# EAGLE design electronic_load_V02.0 (EAGLE 7.3.0)

## Sheet 1 of 2
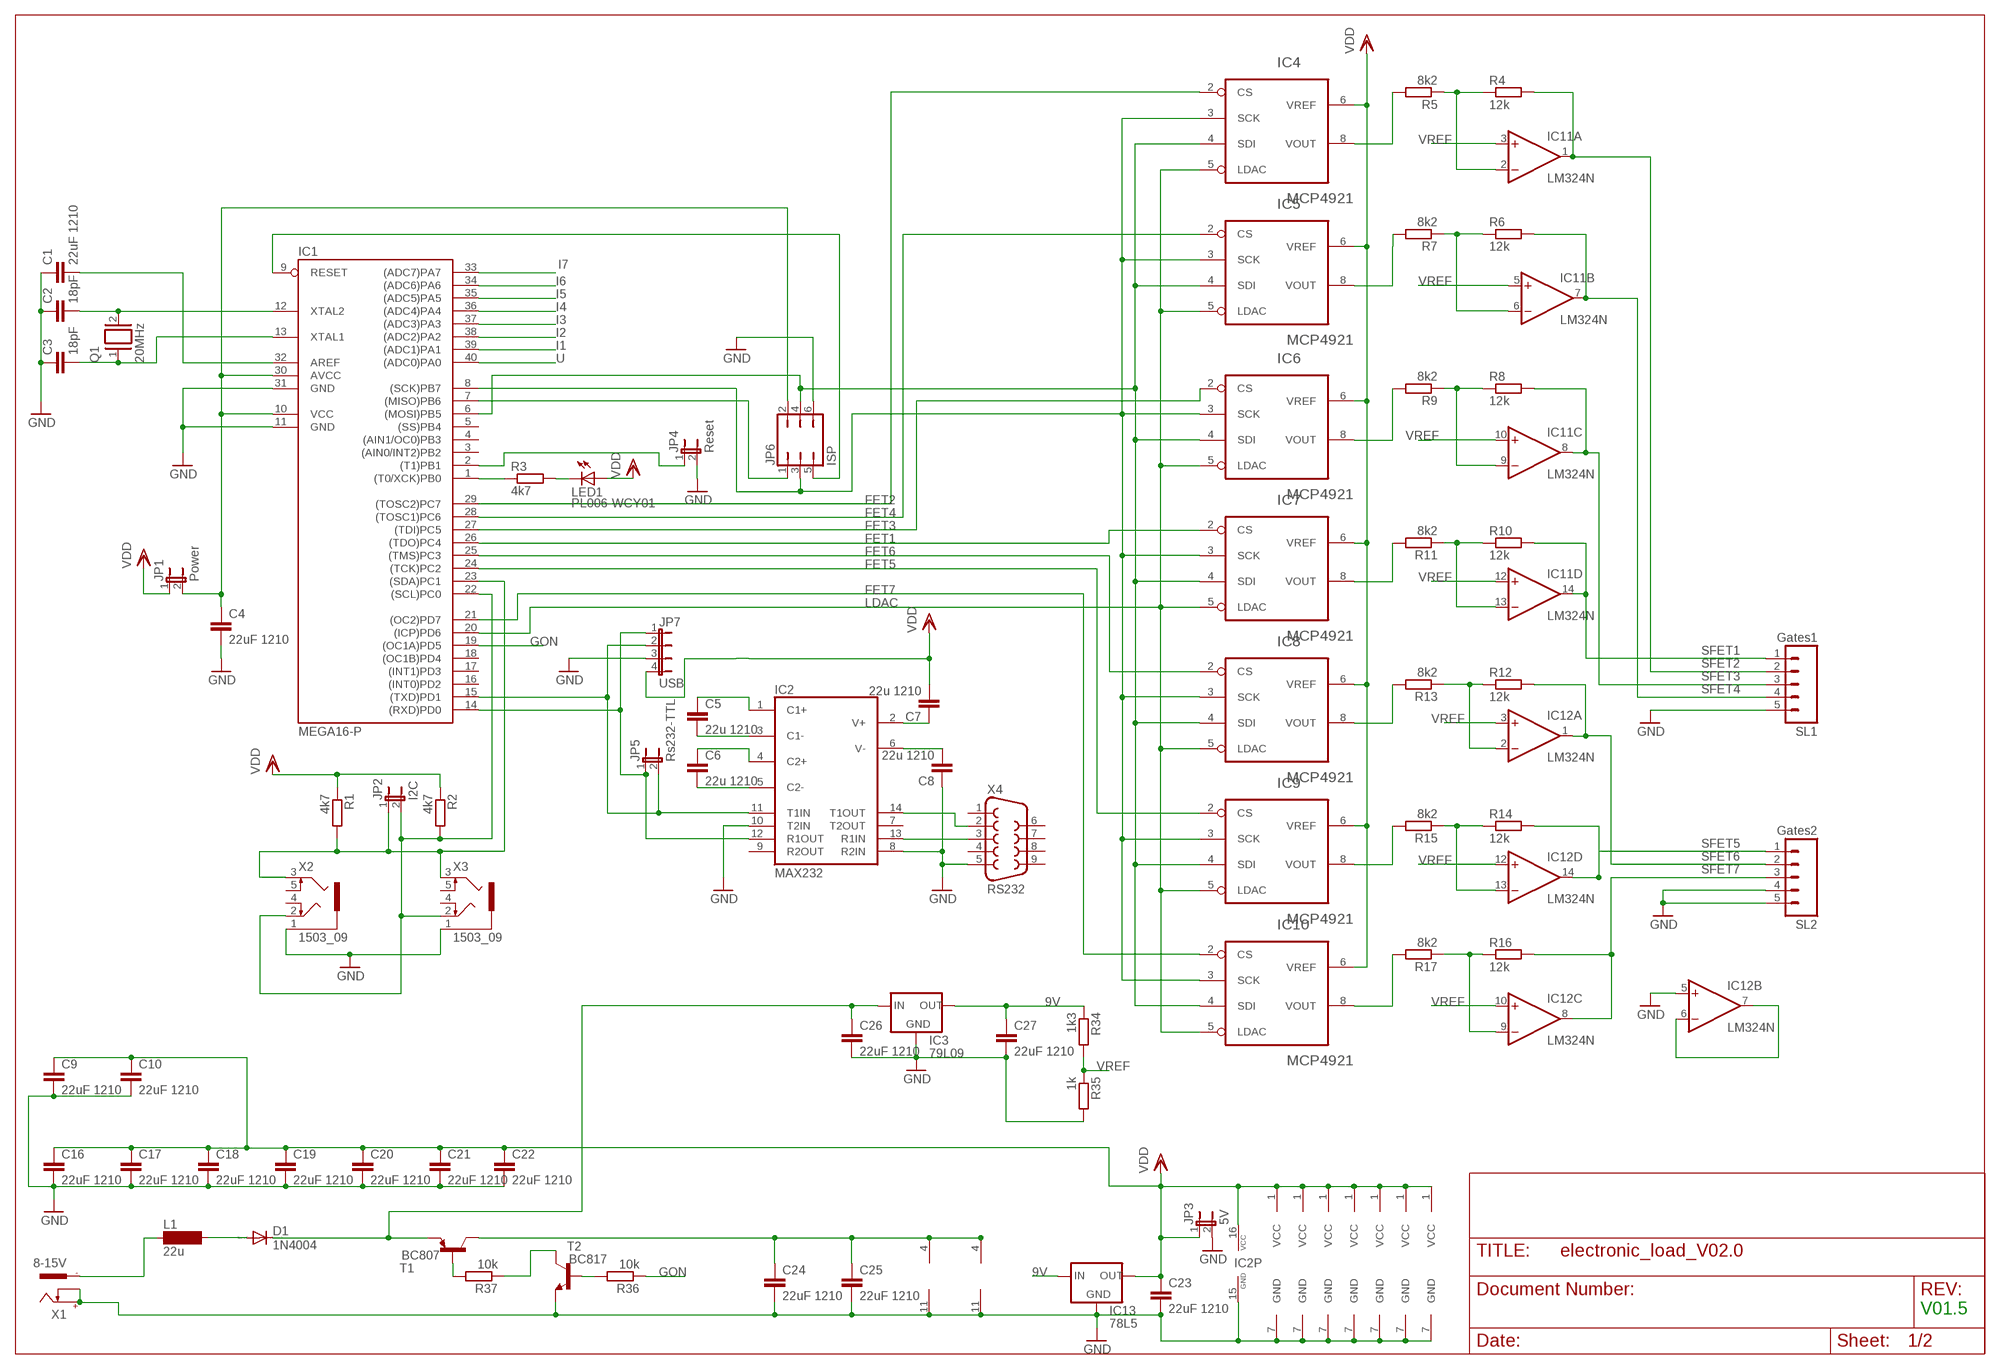
[diagram p0: schematic, sheet 1]

### Parts
C1  22uF 1210  C-EUC1206  [C1206]
C2  18pF  C-EU025-025X050  [C025-025X050]
C3  18pF  C-EU025-025X050  [C025-025X050]
C4  22uF 1210  C-EUC1206  [C1206]
C5  22u 1210  C-EUC1206  [C1206]
C6  22u 1210  C-EUC1206  [C1206]
C7  22u 1210  C-EUC1206  [C1206]
C8  22u 1210  C-EUC1206  [C1206]
C9  22uF 1210  C-EUC1206  [C1206]
C10  22uF 1210  C-EUC1206  [C1206]
C16  22uF 1210  C-EUC1206  [C1206]
C17  22uF 1210  C-EUC1206  [C1206]
C18  22uF 1210  C-EUC1206  [C1206]
C19  22uF 1210  C-EUC1206  [C1206]
C20  22uF 1210  C-EUC1206  [C1206]
C21  22uF 1210  C-EUC1206  [C1206]
C22  22uF 1210  C-EUC1206  [C1206]
C23  22uF 1210  C-EUC1206  [C1206]
C24  22uF 1210  C-EUC1206  [C1206]
C25  22uF 1210  C-EUC1206  [C1206]
C26  22uF 1210  C-EUC1206  [C1206]
C27  22uF 1210  C-EUC1206  [C1206]
D1  1N4004  [DO41-10]
IC1  MEGA16-P  [DIL40]
IC2  MAX232  [DIL16]
IC3  79L09  78LXX  [78LXX]
IC4  MCP4921  MCP491  [DIL08]
IC5  MCP4921  MCP491  [DIL08]
IC6  MCP4921  MCP491  [DIL08]
IC7  MCP4921  MCP491  [DIL08]
IC8  MCP4921  MCP491  [DIL08]
IC9  MCP4921  MCP491  [DIL08]
IC10  MCP4921  MCP491  [DIL08]
IC11  LM324N  [DIL14]
IC12  LM324N  [DIL14]
IC13  78L5  78LXX  [78LXX]
JP1  Power  JP1E  [JP1]
JP2  I2C  JP1E  [JP1]
JP3  5V  JP1E  [JP1]
JP4  Reset  JP1E  [JP1]
JP5  Rs232-TTL  JP1E  [JP1]
JP6  ISP  JP3Q  [JP3Q]
JP7  USB  JP4E  [JP4]
L1  22u  MS85  [MS85]
LED1  PL006-WCY01  [SOT23]
Q1  20MHz  XTAL/S  [QS]
R1  4k7  R-EU_0207/2V  [0207/2V]
R2  4k7  R-EU_0207/2V  [0207/2V]
R3  4k7  R-EU_R1206  [R1206]
R4  12k  R-EU_R1206  [R1206]
R5  8k2  R-EU_R1206  [R1206]
R6  12k  R-EU_R1206  [R1206]
R7  8k2  R-EU_R1206  [R1206]
R8  12k  R-EU_R1206  [R1206]
R9  8k2  R-EU_R1206  [R1206]
R10  12k  R-EU_R1206  [R1206]
R11  8k2  R-EU_R1206  [R1206]
R12  12k  R-EU_R1206  [R1206]
R13  8k2  R-EU_R1206  [R1206]
R14  12k  R-EU_R1206  [R1206]
R15  8k2  R-EU_R1206  [R1206]
R16  12k  R-EU_R1206  [R1206]
R17  8k2  R-EU_R1206  [R1206]
R34  1k3  R-EU_R1206  [R1206]
R35  1k  R-EU_R1206  [R1206]
R36  10k  R-EU_R1206  [R1206]
R37  10k  R-EU_R1206  [R1206]
SL1  Gates1  M05  [05P]
SL2  Gates2  M05  [05P]
T1  BC807  BC807-16-PNP-SOT23-BEC  [SOT23-BEC]
T2  BC817  BC817-16-NPN-SOT23-BEC  [SOT23-BEC]
X1  8-15V  737992-55  [737992-5]
X2  1503_09  [1503_09]
X3  1503_09  [1503_09]
X4  RS232  F09H  [F09H]

### Nets
9V: C27.1 IC3.OUT IC13.IN R34.1
C13: C5.1 IC2.1(C1+)
FET1: IC1.26((TDO)PC4) IC7.2(CS)
FET2: IC1.29((TOSC2)PC7) IC4.2(CS)
FET3: IC1.27((TDI)PC5) IC6.2(CS)
FET4: IC1.28((TOSC1)PC6) IC5.2(CS)
FET5: IC1.24((TCK)PC2) IC9.2(CS)
FET6: IC1.25((TMS)PC3) IC8.2(CS)
FET7: IC1.21((OC2)PD7) IC10.2(CS)
GND: C1.1 C2.1 C3.1 C4.2 C8.1 C9.2 C10.2 C16.2 C17.2 C18.2 C19.2 C20.2 C21.2 C22.2 C23.2 C24.2 C25.2 C26.2 C27.2 IC1.11(GND) IC1.31(GND) IC2.8(R2IN) IC2.10(T2IN) IC2.15(GND) IC3.GND IC4.7(GND) IC5.7(GND) IC6.7(GND) IC7.7(GND) IC8.7(GND) IC9.7(GND) IC10.7(GND) IC11.11(P:V-) IC12.5(B:+IN) IC12.11(P:V-) IC13.GND JP3.2 JP4.2 JP6.6 JP7.3 R35.2 SL1.5 SL2.4 SL2.5 T2.E X1.+ X1.K X2.1 X3.1 X4.5 ; also sheet 2
GON: IC1.19((OC1A)PD5) R36.1
I1: IC1.39((ADC1)PA1) ; also sheet 2
I2: IC1.38((ADC2)PA2) ; also sheet 2
I3: IC1.37((ADC3)PA3) ; also sheet 2
I4: IC1.36((ADC4)PA4) ; also sheet 2
I5: IC1.35((ADC5)PA5) ; also sheet 2
I6: IC1.34((ADC6)PA6) ; also sheet 2
I7: IC1.33((ADC7)PA7) ; also sheet 2
LDAC: IC1.20((ICP)PD6) IC4.5(LDAC) IC5.5(LDAC) IC6.5(LDAC) IC7.5(LDAC) IC8.5(LDAC) IC9.5(LDAC) IC10.5(LDAC)
N$2: IC1.14((RXD)PD0) IC2.12(R1OUT) JP5.1 JP7.1
N$3: C6.2 IC2.5(C2-)
N$4: C4.1 IC1.10(VCC) IC1.30(AVCC) JP1.2 JP6.2
N$5: IC1.23((SDA)PC1) JP2.1 R1.2 X2.3 X3.3
N$6: IC1.15((TXD)PD1) IC2.11(T1IN) JP5.2 JP7.2
N$7: L1.1 X1.-1
N$9: IC2.13(R1IN) X4.3
N$10: IC6.8(VOUT) R9.2
N$12: D1.A L1.2
N$13: C6.1 IC2.4(C2+)
N$14: C5.2 IC2.3(C1-)
N$15: IC1.7((MISO)PB6) JP6.1
N$16: C7.1 IC2.2(V+)
N$17: C8.2 IC2.6(V-)
N$18: IC1.9(RESET) JP6.5
N$19: C2.2 IC1.12(XTAL2) Q1.2
N$20: IC1.6((MOSI)PB5) IC4.4(SDI) IC5.4(SDI) IC6.4(SDI) IC7.4(SDI) IC8.4(SDI) IC9.4(SDI) IC10.4(SDI) JP6.4
N$21: IC7.8(VOUT) R11.2
N$22: IC1.22((SCL)PC0) JP2.2 R2.2 X2.2 X3.2
N$24: IC8.8(VOUT) R13.2
N$26: IC9.8(VOUT) R15.2
N$28: IC1.8((SCK)PB7) IC4.3(SCK) IC5.3(SCK) IC6.3(SCK) IC7.3(SCK) IC8.3(SCK) IC9.3(SCK) IC10.3(SCK) JP6.3
N$31: IC4.8(VOUT) R5.2
N$33: IC2.14(T1OUT) X4.2
N$35: C1.2 IC1.32(AREF)
N$36: IC11.13(D:-IN) R10.1 R11.1
N$37: C3.2 IC1.13(XTAL1) Q1.1
N$38: IC11.9(C:-IN) R8.1 R9.1
N$39: IC10.8(VOUT) R17.2
N$40: IC12.13(D:-IN) R14.1 R15.1
N$42: IC1.1((T0/XCK)PB0) R3.1
N$43: LED1.3(C) R3.2
N$46: IC1.2((T1)PB1) JP4.1
N$55: IC5.8(VOUT) R7.2
N$56: C26.1 D1.C IC3.IN T1.E
N$57: IC12.2(A:-IN) R12.1 R13.1
N$58: IC12.9(C:-IN) R16.1 R17.1
N$59: C24.1 C25.1 IC11.4(P:V+) IC12.4(P:V+) T1.C
N$61: R37.2 T1.B
N$63: R37.1 T2.C
N$64: R36.2 T2.B
N$73: IC11.6(B:-IN) R6.1 R7.1
N$91: IC11.2(A:-IN) R4.1 R5.1
N$96: IC12.6(B:-IN) IC12.7(B:OUT)
SFET1: IC11.14(D:OUT) R10.2 SL1.1
SFET2: IC11.1(A:OUT) R4.2 SL1.2
SFET3: IC11.8(C:OUT) R8.2 SL1.3
SFET4: IC11.7(B:OUT) R6.2 SL1.4
SFET5: IC12.14(D:OUT) R14.2 SL2.1
SFET6: IC12.1(A:OUT) R12.2 SL2.2
SFET7: IC12.8(C:OUT) R16.2 SL2.3
U: IC1.40((ADC0)PA0) ; also sheet 2
VDD: C7.2 C9.1 C10.1 C16.1 C17.1 C18.1 C19.1 C20.1 C21.1 C22.1 C23.1 IC2.16(VCC) IC4.1(VCC) IC4.6(VREF) IC5.1(VCC) IC5.6(VREF) IC6.1(VCC) IC6.6(VREF) IC7.1(VCC) IC7.6(VREF) IC8.1(VCC) IC8.6(VREF) IC9.1(VCC) IC9.6(VREF) IC10.1(VCC) IC10.6(VREF) IC13.OUT JP1.1 JP3.1 JP7.4 LED1.1(A) R1.1 R2.1 ; also sheet 2
VREF: IC11.3(A:+IN) IC11.5(B:+IN) IC11.10(C:+IN) IC11.12(D:+IN) IC12.3(A:+IN) IC12.10(C:+IN) IC12.12(D:+IN) R34.2 R35.1
Unconnected: IC1.3((AIN0/INT2)PB2) IC1.4((AIN1/OC0)PB3) IC1.5((SS)PB4) IC1.16((INT0)PD2) IC1.17((INT1)PD3) IC1.18((OC1B)PD4) IC2.7(T2OUT) IC2.9(R2OUT) X1.-2 X2.4 X2.5 X3.4 X3.5 X4.1 X4.4 X4.6 X4.7 X4.8 X4.9

### Notes on the sheet
- V01.5

## Sheet 2 of 2
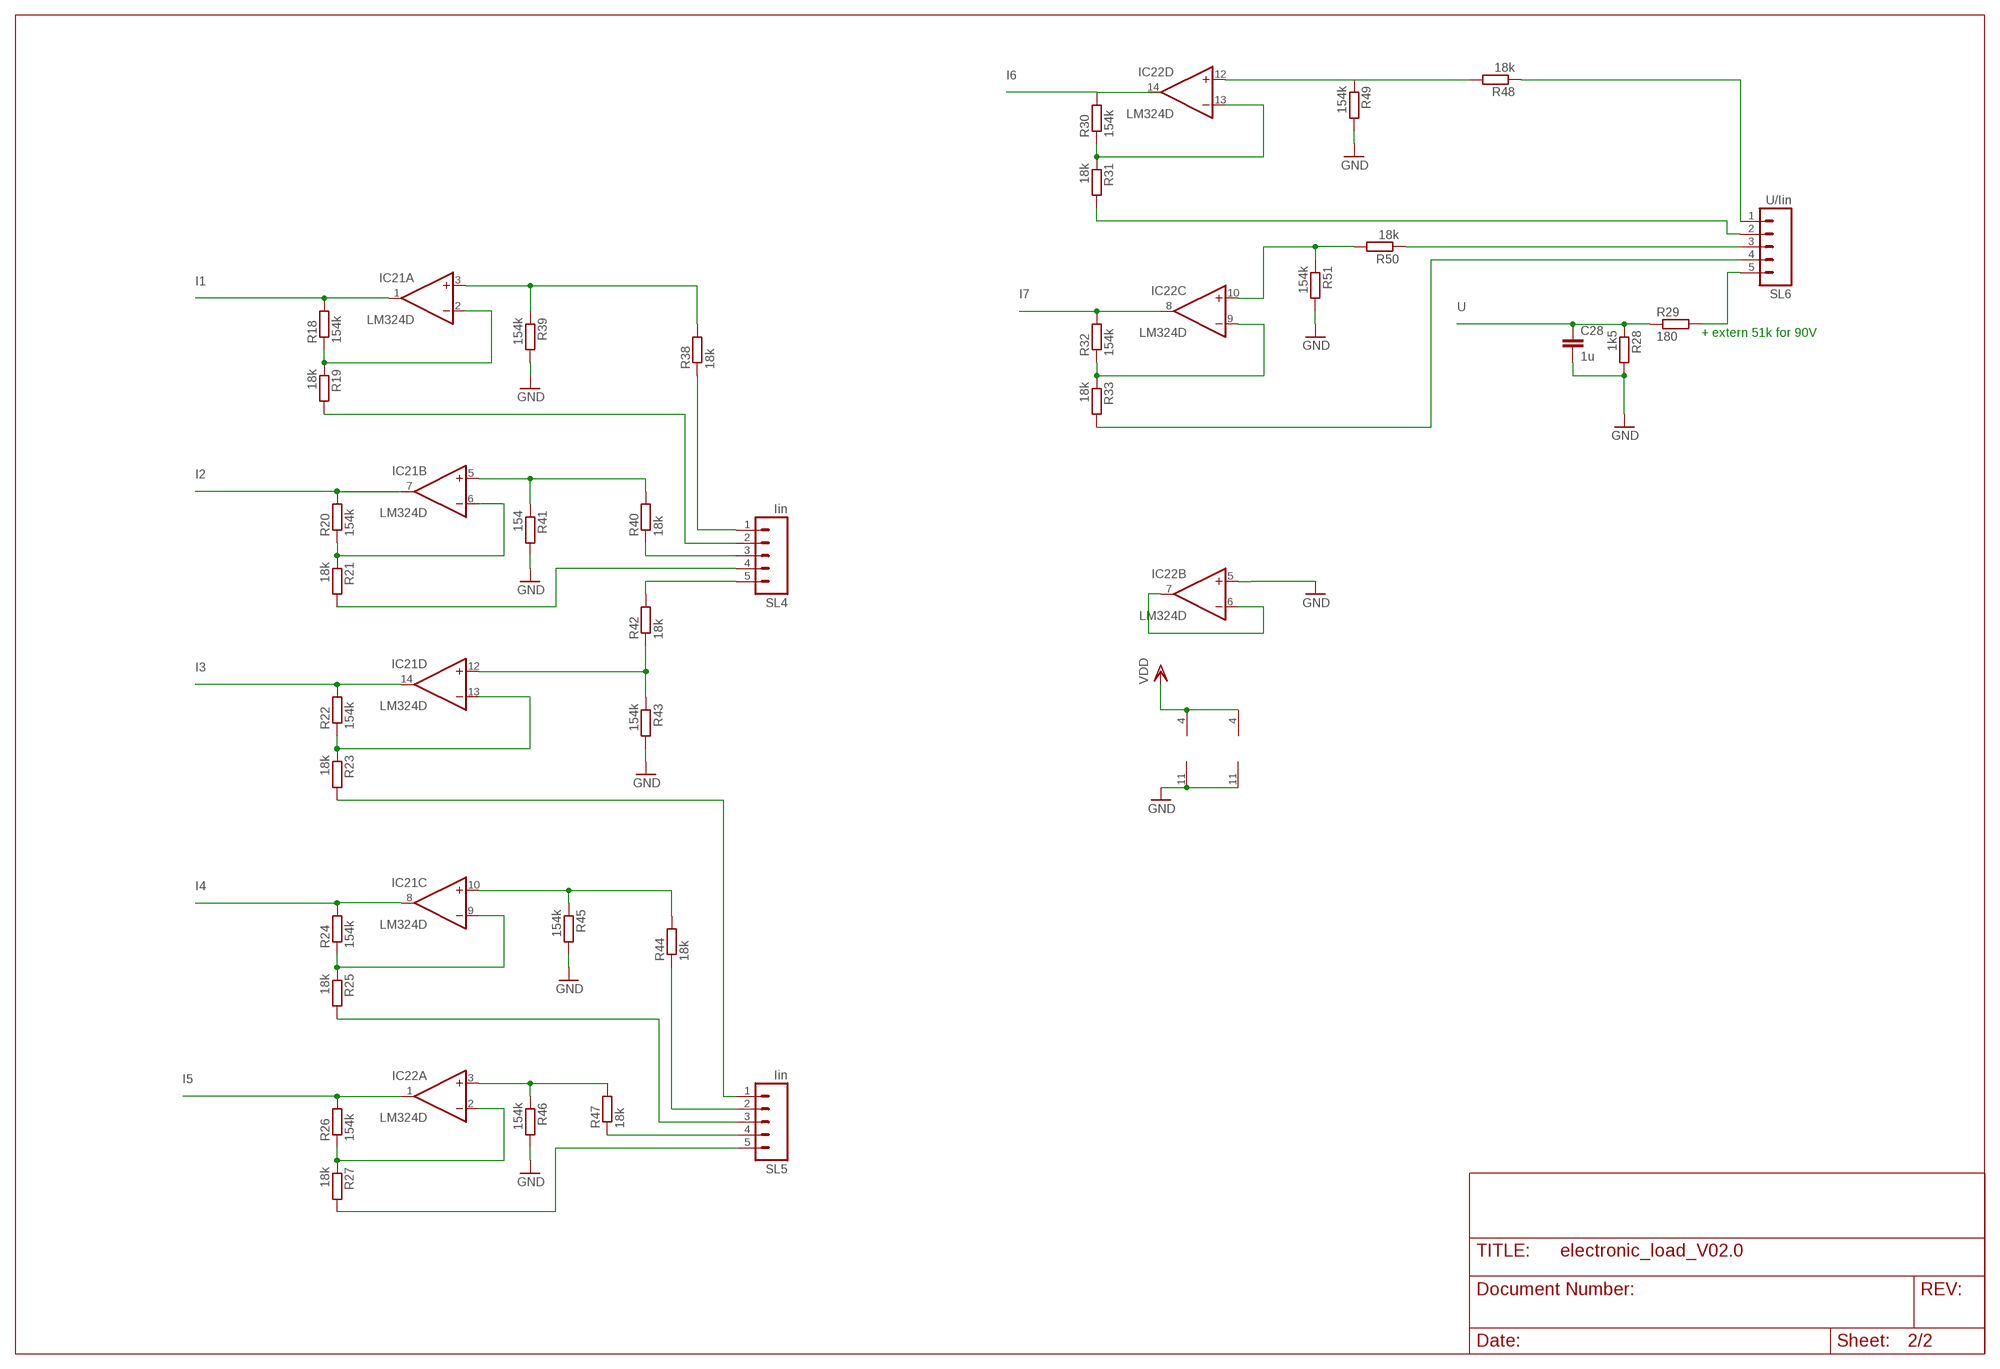
[diagram p1: schematic, sheet 2]

### Parts
C28  1u  C-EUC1206  [C1206]
IC21  LM324D  [SO14]
IC22  LM324D  [SO14]
R18  154k  R-EU_M1206  [M1206]
R19  18k  R-EU_M1206  [M1206]
R20  154k  R-EU_M1206  [M1206]
R21  18k  R-EU_M1206  [M1206]
R22  154k  R-EU_M1206  [M1206]
R23  18k  R-EU_M1206  [M1206]
R24  154k  R-EU_M1206  [M1206]
R25  18k  R-EU_M1206  [M1206]
R26  154k  R-EU_M1206  [M1206]
R27  18k  R-EU_M1206  [M1206]
R28  1k5  R-EU_R1206  [R1206]
R29  180  R-EU_R1206  [R1206]
R30  154k  R-EU_M1206  [M1206]
R31  18k  R-EU_M1206  [M1206]
R32  154k  R-EU_M1206  [M1206]
R33  18k  R-EU_M1206  [M1206]
R38  18k  R-EU_R1206  [R1206]
R39  154k  R-EU_M1206  [M1206]
R40  18k  R-EU_M1206  [M1206]
R41  154  R-EU_M1206  [M1206]
R42  18k  R-EU_M1206  [M1206]
R43  154k  R-EU_M1206  [M1206]
R44  18k  R-EU_M1206  [M1206]
R45  154k  R-EU_M1206  [M1206]
R46  154k  R-EU_M1206  [M1206]
R47  18k  R-EU_M1206  [M1206]
R48  18k  R-EU_M1206  [M1206]
R49  154k  R-EU_M1206  [M1206]
R50  18k  R-EU_M1206  [M1206]
R51  154k  R-EU_M1206  [M1206]
SL4  Iin  M05  [05P]
SL5  Iin  M05  [05P]
SL6  U/Iin  M05  [05P]

### Nets
GND: C28.2 IC21.11(P:V-) IC22.5(B:+IN) IC22.11(P:V-) R28.2 R39.2 R41.2 R43.2 R45.2 R46.2 R49.2 R51.2 ; also sheet 1
I1: IC21.1(A:OUT) R18.2 ; also sheet 1
I2: IC21.7(B:OUT) R20.2 ; also sheet 1
I3: IC21.14(D:OUT) R22.2 ; also sheet 1
I4: IC21.8(C:OUT) R24.2 ; also sheet 1
I5: IC22.1(A:OUT) R26.2 ; also sheet 1
I6: IC22.14(D:OUT) R30.2 ; also sheet 1
I7: IC22.8(C:OUT) R32.2 ; also sheet 1
N$1: IC21.2(A:-IN) R18.1 R19.1
N$8: IC22.6(B:-IN) IC22.7(B:OUT)
N$27: R29.2 SL6.5
N$29: R21.2 SL4.4
N$30: IC21.6(B:-IN) R20.1 R21.1
N$32: IC22.9(C:-IN) R32.1 R33.1
N$34: IC22.13(D:-IN) R30.1 R31.1
N$41: IC21.13(D:-IN) R22.1 R23.1
N$44: IC21.10(C:+IN) R44.2 R45.1
N$45: IC21.9(C:-IN) R24.1 R25.1
N$47: IC22.2(A:-IN) R26.1 R27.1
N$48: R47.1 SL5.4
N$49: IC21.5(B:+IN) R40.2 R41.1
N$52: R48.1 SL6.1
N$53: R31.2 SL6.2
N$54: R25.2 SL5.3
N$60: R27.2 SL5.5
N$65: R38.1 SL4.1
N$66: R40.1 SL4.3
N$67: IC21.3(A:+IN) R38.2 R39.1
N$68: R42.2 SL4.5
N$69: R19.2 SL4.2
N$70: R44.1 SL5.2
N$72: IC22.3(A:+IN) R46.1 R47.2
N$74: IC22.12(D:+IN) R48.2 R49.1
N$76: R50.1 SL6.3
N$79: R23.2 SL5.1
N$80: IC21.12(D:+IN) R42.1 R43.1
N$89: R33.2 SL6.4
N$90: IC22.10(C:+IN) R50.2 R51.1
U: C28.1 R28.1 R29.1 ; also sheet 1
VDD: IC21.4(P:V+) IC22.4(P:V+) ; also sheet 1

### Notes on the sheet
- + extern 51k for 90V

## Library data of the parts
C1 C4-C10 C16-C27 = rcl:C-EU: CAPACITOR, European symbol
C2 C3 C28 = resistor:C-EU: CAPACITOR, European symbol
D1 = diode:1N4004: DIODE general purpose rectifier, 1 A
IC1 = atmel:MEGA16-P: MICROCONTROLLER 16 Kbytes FLASH 1 kbytes SRAM 512 bytes EEPROM USART 8-channel 10 bit ADC Source: avr.lbr; MPN: ATMEGA16-16PU; OC_FARNELL: 9171142; OC_NEWARK: 01M6885
IC2 = maxim:MAX232: RS232 TRANSCEIVER; MF: MAXIM; MPN: MAX232ACPE+; OC_FARNELL: 9723773; OC_NEWARK: 68K4544
IC3 IC13 = v-reg:78LXX: VOLTAGE REGULATOR
IC4-IC10 = dac:MCP49*1: Digital-to-Analog Converter
IC11 IC12 IC21 IC22 = linear:LM324: OP AMP
JP1-JP5 = jumper:JP1E: JUMPER
JP6 = jumper:JP3Q: JUMPER
JP7 = jumper:JP4E: JUMPER
L1 = inductor-neosid:MS85: INDUCTOR SMD power inductor; OC_FARNELL: unknown; OC_NEWARK: unknown
LED1 = led:PL006*: PLH006 Series SMD LED SOT23 PLH006-WCR21 Super Red PLH006-WCR12 High Eff Red PLH006-WCG13 Green PLH006-WCY01 Yellow www.p-tec.net Source: http://www.wittig-electronic.de/PTEC/PL006Series.pdf
Q1 = special:XTAL/S: CRYSTAL
R1-R51 = resistor:R-EU_: RESISTOR, European symbol
SL1 SL2 SL4-SL6 = con-amp-quick:M05: AMP QUICK CONNECTOR; OC_FARNELL: unknown; OC_NEWARK: unknown
T1 = transistor:*-PNP-: PNP Transistror
T2 = transistor:*-NPN-: NPN Transistror BF959 corrected 2008.03.06
X1 = con-conrad:737992-55: FEMALE PRINT CONNECTOR DIN 45323 (34V/3A), ROKA, distributor Conrad
X2 X3 = con-lumberg:1503_09: Jack connectors according to JISC 6560, 3.5 mm Klinkeneinbaukupplung nach JISC 6560, 3,5 mm, 3-polig/ stereo, abgewinkelte Ausführung, mit 2 Öffnern und Lötaugen, für Leiterplatten Rückseitenmontage Source: http://www.lumberg.com/Produkte/PDFs/1503_09.pdf; OC_FARNELL: 1243244; OC_NEWARK: unknown
X4 = con-subd:F09: SUB-D; OC_FARNELL: unknown; OC_NEWARK: unknown

## Board
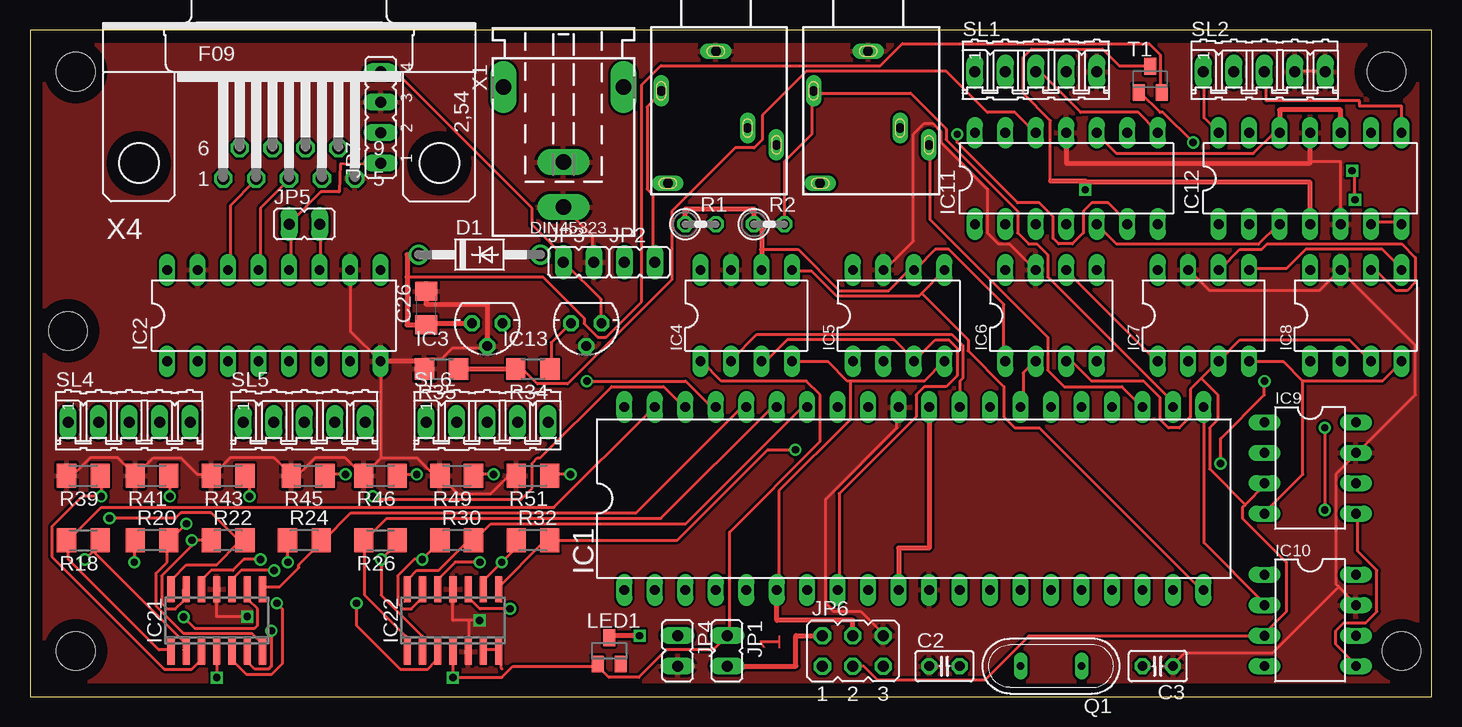
[diagram p2: board, top side]
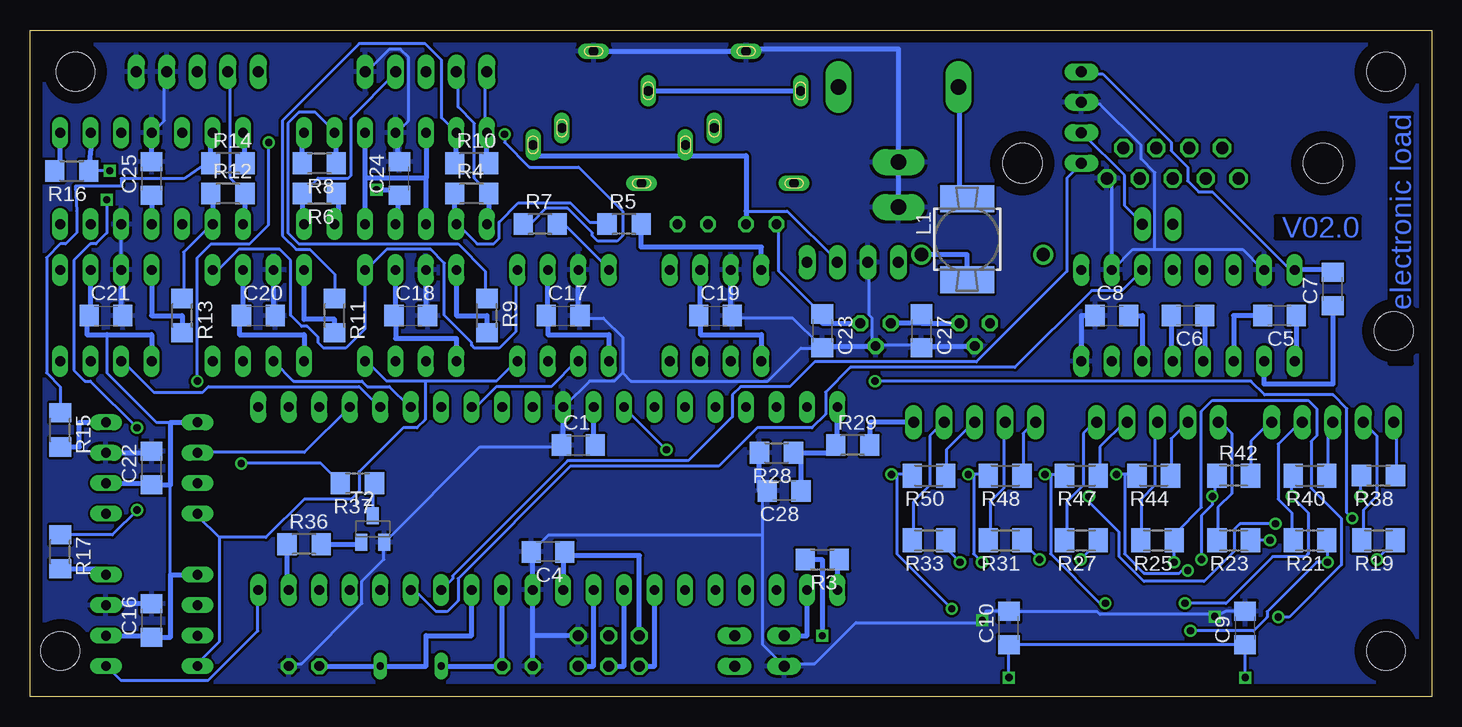
[diagram p3: board, bottom side, seen from below]

Size 116.82 x 55.55 mm. Coordinates in mm from the lower left corner, seen from the top.
Outline: 0,0 116.82,0 116.82,55.55 0,55.55 0,0
Copper layers (1*16): Top 0.035mm / dielectric 1.5mm / Bottom 0.035mm
Design rules "default": minimum track width 10mil, minimum drill 24mil, track to track 8mil, track to pad 8mil, pad to pad 8mil, via to via 8mil, smd to smd 8mil, copper to edge 40mil, drill to drill 8mil, minimum pad ring 10mil, minimum via ring 8mil, stop-mask expansion 4mil, vias tented up to drill 0mil, thermal gap 10mil
Holes 3.2 mm at 3.81,52.07 3.81,3.81 114.3,3.81 113.03,52.07 3.17,30.48

### Footprints (pad centres in the part's own frame; a part is rotated, then mirrored left to right if it is on the bottom)
C1206 = smd 1.6 x 1.8: 1 -1.4,0; 2 1.4,0
C025-025X050 = drill 0.813 octagon: 1 -1.27,0; 2 1.27,0
DO41-10 = drill 1.118: A 5.08,0; C -5.08,0
DIL40 = drill 0.813 long: 1 -24.13,-7.62; 2 -21.59,-7.62; 3 -19.05,-7.62; 4 -16.51,-7.62; 5 -13.97,-7.62; 6 -11.43,-7.62; 7 -8.89,-7.62; 8 -6.35,-7.62; 9 -3.81,-7.62; 10 -1.27,-7.62; 11 1.27,-7.62; 12 3.81,-7.62; 13 6.35,-7.62; 14 8.89,-7.62; 15 11.43,-7.62; 16 13.97,-7.62; 17 16.51,-7.62; 18 19.05,-7.62; 19 21.59,-7.62; 20 24.13,-7.62; 21 24.13,7.62; 22 21.59,7.62; 23 19.05,7.62; 24 16.51,7.62; 25 13.97,7.62; 26 11.43,7.62; 27 8.89,7.62; 28 6.35,7.62; 29 3.81,7.62; 30 1.27,7.62; 31 -1.27,7.62; 32 -3.81,7.62; 33 -6.35,7.62; 34 -8.89,7.62; 35 -11.43,7.62; 36 -13.97,7.62; 37 -16.51,7.62; 38 -19.05,7.62; 39 -21.59,7.62; 40 -24.13,7.62
DIL16 = drill 0.813 long: 1 -8.89,-3.81; 2 -6.35,-3.81; 3 -3.81,-3.81; 4 -1.27,-3.81; 5 1.27,-3.81; 6 3.81,-3.81; 7 6.35,-3.81; 8 8.89,-3.81; 9 8.89,3.81; 10 6.35,3.81; 11 3.81,3.81; 12 1.27,3.81; 13 -1.27,3.81; 14 -3.81,3.81; 15 -6.35,3.81; 16 -8.89,3.81
78LXX = drill 0.813 octagon: GND 0,1.905; IN 1.27,0; OUT -1.27,0
DIL08 = drill 0.813 long: 1 -3.81,-3.81; 2 -1.27,-3.81; 3 1.27,-3.81; 4 3.81,-3.81; 5 3.81,3.81; 6 1.27,3.81; 7 -1.27,3.81; 8 -3.81,3.81
DIL14 = drill 0.813 long: 1 -7.62,-3.81; 2 -5.08,-3.81; 3 -2.54,-3.81; 4 0,-3.81; 5 2.54,-3.81; 6 5.08,-3.81; 7 7.62,-3.81; 8 7.62,3.81; 9 5.08,3.81; 10 2.54,3.81; 11 0,3.81; 12 -2.54,3.81; 13 -5.08,3.81; 14 -7.62,3.81
SO14 = smd 0.6 x 2.2: 1 -3.81,-2.6; 2 -2.54,-2.6; 3 -1.27,-2.6; 4 0,-2.6; 5 1.27,-2.6; 6 2.54,-2.6; 7 3.81,-2.6; 8 3.81,2.6; 9 2.54,2.6; 10 1.27,2.6; 11 0,2.6; 12 -1.27,2.6; 13 -2.54,2.6; 14 -3.81,2.6
JP1 = drill 0.914 long: 1 0,-1.27; 2 0,1.27
JP3Q = drill 0.914 octagon: 1 -2.54,-1.27; 2 -2.54,1.27; 3 0,-1.27; 4 0,1.27; 5 2.54,-1.27; 6 2.54,1.27
JP4 = drill 0.914 long: 1 -3.81,0; 2 -1.27,0; 3 1.27,0; 4 3.81,0
MS85 = smd 4.5 x 2.25: 1 0,-3.383; 2 0,3.383
SOT23 = smd 1 x 1.4: 1 -0.95,-1.1; 2 0.95,-1.1; 3 0,1.1
QS = drill 0.61 long: 1 -2.54,0; 2 2.54,0
0207/2V = drill 0.813 octagon: 1 -1.27,0; 2 1.27,0
R1206 = smd 1.6 x 1.803: 1 -1.422,0; 2 1.422,0
M1206 = smd 1.6 x 2: 1 -1.4,0; 2 1.4,0
05P = drill 0.914 long: 1 -5.08,0; 2 -2.54,0; 3 0,0; 4 2.54,0; 5 5.08,0
SOT23-BEC = smd 1 x 1.4: B -0.95,-1.1; C 0,1.1; E 0.95,-1.1
737992-5 = drill 1.3 pad 2.184 long: + 0,10; -1 5,0; -2 -5,0; K 0,6.25
1503_09 = drill 0.8 pad 1.2 long: 1 0,-2.1; 2 -4.55,-5.4; 3 5.05,-9.9; 4 -4,-13.1; 5 2.65,-8.5
F09H = drill 1.016 octagon: 1 -5.486,-1.27; 2 -2.743,-1.27; 3 0,-1.27; 4 2.743,-1.27; 5 5.486,-1.27; 6 -4.115,1.27; 7 -1.372,1.27; 8 1.372,1.27; 9 4.115,1.27 | hole 3.302: -12.522,0; 12.522,0

### Placement (x,y rotation side)
C1  71.12,20.95 0 bottom
C2  76.2,2.54 0 top
C3  93.98,2.54 180 top
C4  73.66,12.06 180 bottom
C5  12.7,31.75 180 bottom
C6  20.32,31.75 180 bottom
C7  8.26,33.97 90 bottom
C8  26.67,31.75 0 bottom
C9  15.56,5.71 90 bottom
C10  35.24,5.71 90 bottom
C16  106.68,6.35 90 bottom
C17  72.39,31.75 0 bottom
C18  85.09,31.75 0 bottom
C19  59.69,31.75 0 bottom
C20  97.79,31.75 0 bottom
C21  110.49,31.75 0 bottom
C22  106.68,19.05 90 bottom
C23  50.8,30.48 270 bottom
C24  86.04,43.18 90 bottom
C25  106.68,43.18 90 bottom
C26  33.02,32.38 90 top
C27  42.55,30.48 270 bottom
C28  53.98,17.14 180 bottom
D1  37.47,36.83 0 top
IC1  73.66,16.51 0 top
IC2  20.32,31.75 0 top
IC3  38.1,31.11 180 top
IC4  59.69,31.75 0 top
IC5  72.39,31.75 0 top
IC6  85.09,31.75 0 top
IC7  97.79,31.75 0 top
IC8  110.49,31.75 0 top
IC9  106.68,19.05 270 top
IC10  106.68,6.35 270 top
IC11  86.36,43.18 0 top
IC12  106.68,43.18 0 top
IC13  46.35,31.11 180 top
IC21  15.56,6.35 0 top
IC22  35.24,6.35 0 top
JP1  58.1,3.81 180 top
JP2  50.8,36.2 270 top
JP3  45.72,36.2 270 top
JP4  53.98,3.81 180 top
JP5  22.86,39.37 270 top
JP6  68.58,3.81 0 top
JP7  29.21,48.26 90 top
L1  38.73,38.1 180 bottom
LED1  48.26,3.81 0 top
Q1  85.09,2.54 180 top
R1  55.88,39.37 0 top
R2  61.59,39.37 0 top
R3  50.8,11.43 180 bottom
R4  80.01,41.91 0 bottom
R5  67.31,39.37 0 bottom
R6  92.71,41.91 180 bottom
R7  74.3,39.37 0 bottom
R8  92.71,44.45 180 bottom
R9  78.74,31.75 270 bottom
R10  80.01,44.45 0 bottom
R11  91.44,31.75 270 bottom
R12  100.33,41.91 0 bottom
R13  104.14,31.75 270 bottom
R14  100.33,44.45 0 bottom
R15  114.3,22.23 270 bottom
R16  113.35,43.81 180 bottom
R17  114.3,12.06 270 bottom
R18  4.45,13.02 180 top
R19  4.45,13.02 180 bottom
R20  10.16,13.02 0 top
R21  10.16,13.02 180 bottom
R22  16.51,13.02 0 top
R23  16.51,13.02 180 bottom
R24  22.86,13.02 0 top
R25  22.86,13.02 180 bottom
R26  29.21,13.02 180 top
R27  29.21,13.02 180 bottom
R28  54.61,20.32 180 bottom
R29  48.26,20.95 0 bottom
R30  35.56,13.02 0 top
R31  35.56,13.02 180 bottom
R32  41.91,13.02 0 top
R33  41.91,13.02 180 bottom
R34  41.91,27.3 180 top
R35  34.29,27.3 180 top
R36  93.98,12.7 0 bottom
R37  89.53,17.78 180 bottom
R38  4.45,18.41 180 bottom
R39  4.45,18.41 180 top
R40  10.16,18.41 180 bottom
R41  10.16,18.41 180 top
R42  16.51,18.41 0 bottom
R43  16.51,18.41 180 top
R44  23.18,18.41 180 bottom
R45  23.18,18.41 180 top
R46  29.21,18.41 180 top
R47  29.21,18.41 180 bottom
R48  35.56,18.41 180 bottom
R49  35.56,18.41 180 top
R50  41.91,18.41 180 bottom
R51  41.91,18.41 180 top
SL1  83.82,52.07 0 top
SL2  102.87,52.07 0 top
SL4  8.26,22.86 0 top
SL5  22.86,22.86 0 top
SL6  38.1,22.86 0 top
T1  93.34,51.44 0 top
T2  88.27,13.97 0 bottom
X1  44.45,50.8 180 top
X2  69.85,55.88 0 top
X3  57.15,55.88 0 top
X4  21.59,44.45 0 top

### Tracks (layer width: path | path; a pad name or v marks a point on that pad's centre or on a via)
9V
  Top 0.254: R34.1 43.43,27.43 43.43,29.49 45.03,31.09 IC13.IN
  Bottom 0.406: 42.55,31.11 IC3.OUT | C27.1 42.55,31.11 | 42.55,31.11 IC13.IN
C13
  Bottom 0.406: C5.1 11.3,27.94 IC2.1
FET1
  Bottom 0.254: IC7.2 94.87,26.29 89.15,26.29 88.7,25.83 86.87,25.83 85.27,24.23 IC1.26
FET2
  Top 0.254: IC1.29 77.5,24.23 77.5,26.29 77.72,26.52 77.72,29.26 76.81,30.18 60.58,30.18 58.52,28.12 IC4.2
FET3
  Top 0.254: IC1.27 82.75,24.23 82.75,26.98 83.67,27.89 IC6.2
FET4
  Bottom 0.254: IC1.28 80.01,24.23 79.55,24.23 77.95,25.83 73.38,25.83 71.32,27.89 IC5.2
FET5
  Bottom 0.254: IC1.24 93.95,20.34 102.87,20.34 IC9.2
FET6
  Bottom 0.254: IC1.25 87.78,24.23 89.38,25.83 101.96,25.83 102.41,25.38 106.53,25.38 109.04,27.89 IC8.2
FET7
  Top 0.254: IC1.21 97.84,24 97.84,12.8 102.87,7.77 IC10.2
GND  (via drill 0.6)
  Top 0.254: JP3.2 46.86,36.35 46.86,38.41 44.58,40.69 X1.+ | R35.2 32.92,28.12 34.29,28.12 35.2,29.03 37.95,29.03 IC3.GND | IC2.10 26.75,35.43 26.75,30.4 IC2.8 29.26,27.89 29.26,19.89 | IC7.7 96.7,35.43 98.3,33.83 107.44,33.83 109.04,35.43 IC8.7 109.27,35.43 115.44,29.26 115.44,25.15 110.64,20.34 IC9.7 110.41,20.12 108.81,18.52 108.81,9.37 109.04,9.14 | SL2.4 105.61,52.12 107.9,52.12 SL2.5 | IC6.7 83.67,35.66 81.61,37.72 80.7,37.72 79.78,38.63 79.78,42.29 75.89,46.18 75.89,47.09 75.21,47.78 74.52,47.78 73.61,46.86 73.61,37.95 71.32,35.66 IC5.7 | 109.04,9.14 110.41,7.77 IC10.7 | 109.04,9.14 103.56,3.66 96.24,3.66 95.33,2.74 C3.1 | IC12.5 109.22,44.58 C25.2 | IC1.31 72.24,24 72.24,22.4 66.29,16.46 66.29,7.77 66.98,7.09 69.27,7.09 71.09,5.26 JP6.6 | v18.1,6.67 15.56,6.67 IC21.11 | v37.47,6.35 36.58,6.35 | 36.58,6.35 35.24,6.35 IC22.11 | 36.58,6.35 36.58,3.89 IC22.5 | 36.58,6.4 36.58,6.35 | R39.2 3.2,18.52 3.66,18.52 5.03,19.89 7.32,19.89 8.69,18.52 R41.2 8.91,18.52 10.29,19.89 12.57,19.89 13.95,18.52 15.09,18.52 R43.2 15.32,18.52 16.69,19.89 20.34,19.89 21.72,18.52 R45.2 21.95,18.52 22.4,18.52 23.77,19.89 26.29,19.89 27.66,18.52 R46.2 27.89,18.52 29.26,19.89 | 29.26,19.89 32.23,19.89 33.6,18.52 34.06,18.52 R49.2 34.29,18.29 35.66,16.92 38.41,16.92 39.78,18.29 40.46,18.29 R51.2
  Top 0.406: C26.2 33.02,32.7 38.1,32.7 IC3.GND | R35.2 32.87,27.94 IC2.8 | 86.36,47.62 IC11.11 86.36,44.45 106.68,44.45 C25.2 IC12.11
  Bottom 0.254: 23.09,37.26 24.92,37.26 26.52,35.66 IC2.10 | 23.09,37.26 15.77,37.26 14.17,35.66 IC2.15 | 23.09,37.26 23.09,43.66 24.23,44.81 24.23,45.95 27.66,49.38 29.03,49.38 JP7.3 | C19.2 58.06,31.55 53.26,31.55 50.98,29.26 C23.2 50.98,29.03 52.58,29.03 55.32,26.29 66.75,26.29 67.44,26.98 | C27.2 42.75,29.26 46.18,29.26 IC13.GND 46.63,29.26 46.63,31.55 46.86,31.77 46.86,36.12 JP3.2 | SL1.5 88.7,52.12 86.87,53.95 85.95,53.95 85.27,53.26 85.27,48.01 86.18,47.09 IC11.11 | SL2.4 105.61,51.89 105.61,48.01 106.53,47.09 IC12.11 | IC8.7 109.27,35.66 109.27,39.32 IC12.5 | 67.44,26.98 68.12,26.29 70.18,26.29 72.24,24.23 IC1.31 | 67.44,26.98 67.44,29.95 69.04,31.55 70.87,31.55 C17.2 | C3.1 95.1,2.74 94.18,2.74 89.15,7.77 89.15,9.6 87.33,11.43 87.33,12.8 T2.E 87.1,13.03 79.32,20.8 72.69,20.8 C1.1 | 55.78,17.14 55.78,13.49 | 55.78,13.49 55.78,4.34 JP4.2 53.95,2.74 51.44,2.74 48.01,6.17 37.49,6.17 v37.47,6.35 37.15,7.12 C10.2 35.2,7.09 27.89,7.09 27.66,6.86 18.29,6.86 v18.1,6.67 17.14,7.12 C9.2 | 55.78,13.49 73.61,13.49 74.98,12.12 C4.2
  Bottom 0.305: X4.5 26.67,43.18 IC2.10
  Bottom 0.406: C4.2 75.06,11.43 74.93,11.43 IC1.11 74.93,5.08 | C1.1 72.39,20.95 IC1.31 | C16.2 110.49,7.75 IC10.7 | IC9.7 106.68,20.32 C22.2 | C21.2 109.22,31.75 IC8.7 | C20.2 96.52,31.75 IC7.7 | C18.2 83.82,31.75 IC6.7 | C17.2 71.12,31.75 IC5.7 | C19.2 58.42,31.75 IC4.7 | 69.85,53.66 X2.1 X3.1 57.15,53.98 44.45,53.98 X1.K X1.+ | C27.2 42.55,29.21 IC3.GND | C23.2 50.8,29.21 IC13.GND | C8.1 29.21,31.75 IC2.8 | JP6.6 74.93,5.08 | C2.1 74.93,5.08 | 106.68,44.77 C25.2 IC12.11 | C28.2 55.78,17.14 56.03,17.14 R28.2 | C24.2 IC11.11
  pour Bottom: 1.27,54.29 115.89,54.29 115.89,1.27 1.27,1.27 1.27,53.98
  pour Top: 1.27,54.29 115.89,54.29 115.89,1.27 1.27,1.27
GON
  Bottom 0.406: IC1.19 95.4,8.89 R36.1
I1
  Top 0.254: IC21.1 11.66,3.89 10.74,3.89 3.2,11.43 3.2,12.8 R18.2 3.2,13.03 5.94,15.77 43.66,15.77 51.89,24 IC1.39
I2  (via drill 0.61)
  Top 0.254: IC21.7 19.2,3.89 19.2,4.57 18.52,5.26 12.8,5.26 10.52,7.54 10.52,10.29 11.43,11.2 11.43,12.8 R20.2 11.66,13.03 v13.03,14.4 | v28.57,16.69 28.8,16.46 40.92,16.46 41.83,17.37 41.83,19.43 42.29,19.89 42.52,19.89 48.46,25.83 52.81,25.83 54.41,24.23 IC1.38
  Bottom 0.254: v28.57,16.69 28.57,16.23 26.06,13.72 26.06,11.66 24,9.6 18.97,9.6 16.46,12.12 16.46,13.95 16,14.4 v13.03,14.4
I3  (via drill 0.61)
  Top 0.254: 17.6,12.8 17.37,12.8 15.54,10.97 13.03,10.97 11.89,9.83 11.89,9.14 IC21.14 | 17.6,12.8 17.83,12.8 R22.2 17.6,12.8 | v46.41,26.29 54.63,26.29 56.69,24.23 57.15,24.23 IC1.37 | v6.63,14.86 12.12,14.86 12.57,15.32 15.09,15.32 17.6,12.8
  Bottom 0.254: v46.41,26.29 15.09,26.29 13.95,25.15 8.23,25.15 7.09,24 7.09,15.32 v6.63,14.86
I4
  Top 0.254: IC21.8 19.43,9.14 20.8,9.14 22.4,10.74 22.4,10.97 24.23,12.8 R24.2 24.46,13.03 26.75,15.32 50.52,15.32 59.21,24 59.66,24 IC1.36
I5
  Top 0.254: IC22.1 31.32,3.89 31.32,5.03 27.89,8.46 27.89,12.8 R26.2 27.89,13.03 29.72,14.86 52.58,14.86 61.72,24 62.18,24 IC1.35
I6
  Top 0.254: IC22.14 31.55,9.14 31.55,9.83 32.23,10.52 34.06,10.52 36.35,12.8 36.8,12.8 R30.2 37.03,13.03 38.41,14.4 54.63,14.4 64.24,24 64.69,24 IC1.34
I7  (via drill 0.61)
  Top 0.254: IC22.8 39.09,9.14 42.75,12.8 43.2,12.8 R32.2 43.43,13.03 53.95,13.03 61.49,20.57 v63.78,20.57
  Bottom 0.254: v63.78,20.57 67.21,24 IC1.33
LDAC
  Top 0.254: IC9.5 110.64,15.09 110.64,12.12 112.24,10.52 112.24,7.09 111.33,6.17 109.5,6.17 108.81,5.49 108.81,4.34 110.41,2.74 IC10.5 | IC7.5 101.73,35.66 104.7,35.66 106.3,37.26 112.7,37.26 114.3,35.66 IC8.5 | 74.3,33.6 76.12,35.43 IC5.5 | 74.3,33.6 74.07,33.38 67.21,33.38 65.15,35.43 63.55,35.43 IC4.5 | 74.3,33.6 78.18,29.72 78.18,28.8 81.15,25.83 81.15,23.32 82.07,22.4 84.12,22.4 97.61,8.91 IC1.20
  Bottom 0.254: IC1.20 97.84,8.69 97.84,5.49 101.96,1.37 109.27,1.37 110.41,2.52 IC10.5 | IC5.5 76.35,35.43 76.35,30.4 77.72,29.03 79.78,29.03 80.01,29.26 80.01,29.49 82.3,31.77 82.3,36.12 83.44,37.26 87.1,37.26 88.7,35.66 IC6.5 88.92,35.43 88.92,30.63 90.53,29.03 92.35,29.03 92.81,29.49 92.81,29.95 93.73,30.86 94.18,30.86 95.1,31.77 95.1,36.35 96.01,37.26 99.44,37.26 101.04,35.66 101.5,35.66 IC7.5
N$1  (via drill 0.61)
  Top 0.254: 5.26,12.12 5.94,12.8 R18.1 5.26,12.12 | 5.26,12.12 v4.57,11.43 | 5.26,12.12 12.8,4.57 12.8,3.89 IC21.2
  Bottom 0.254: v4.57,11.43 3.2,12.8 R19.1
N$2
  Top 0.254: IC2.12 21.72,35.66 21.72,39.32 JP5.1 21.72,39.55 24.23,42.06 25.76,42.06 25.86,44.39 29.03,44.35 JP7.1
  Bottom 0.254: IC1.14 81.61,9.83 81.61,10.06 72.01,19.66 61.95,19.66 58.29,23.32 58.29,25.15 57.61,25.83 53.49,25.83 51.44,27.89 37.95,27.89 30.4,35.43 30.4,43.2 29.26,44.35 JP7.1
N$3
  Bottom 0.406: C6.2 21.72,27.94 IC2.5
N$4
  Top 0.406: JP1.2 63.82,2.54 63.82,5.08 JP6.2 | IC1.30 74.93,12.38 72.39,12.38 IC1.10
  Bottom 0.406: JP6.2 66.04,11.75 72.26,11.75 C4.1 72.39,12.06 IC1.10
N$5
  Top 0.254: IC1.23 92.58,24.23 90.98,25.83 86.18,25.83 84.81,27.2 84.81,29.95 74.98,39.78 74.98,45.95 X2.3
  Bottom 0.254: 57.15,40.46 53.72,40.46 49.61,36.35 JP2.1
  Bottom 0.406: X2.3 75.25,45.98 75.25,45.09 62.2,45.09 | 62.2,45.09 X3.3 | 62.2,45.09 57.15,45.09 57.15,40.46 R1.2
N$6
  Top 0.254: JP5.2 24.23,39.32 24.23,35.66 IC2.11
  Bottom 0.254: IC1.15 85.04,8.69 84.58,8.69 82.98,7.09 82.07,7.09 81.15,8 81.15,9.83 71.78,19.2 59.44,19.2 56.24,22.4 51.66,22.4 50.52,23.55 50.52,25.38 48.46,27.43 34.75,27.43 28.35,33.83 25.83,33.83 24.23,35.43 IC2.11 | JP7.2 29.03,46.86 25.6,43.43 25.6,40.92 24.23,39.55 JP5.2
N$7
  Bottom 0.406: X1.-1 39.37,50.8 39.37,41.48 L1.1
N$8
  Top 0.254: 39.32,2.29 IC22.7 38.86,3.89 37.95,3.89 IC22.6
N$9
  Top 0.254: IC2.13 19.2,35.66 19.2,40.69 21.49,42.98 X4.3
N$10
  Bottom 0.406: IC6.8 81.28,31.75 78.74,31.75 R9.2
N$12
  Bottom 0.406: L1.2 38.73,36.83 D1.A
N$13
  Bottom 0.406: C6.1 18.92,27.94 IC2.4
N$14
  Bottom 0.406: C5.2 16.51,31.75 IC2.3
N$15
  Bottom 0.406: JP6.1 64.77,2.54 IC1.7
N$16
  Bottom 0.406: C7.1 8.26,26.04 13.97,26.04 IC2.2
N$17
  Bottom 0.406: C8.2 24.13,31.75 IC2.6
N$18
  Bottom 0.406: JP6.5 69.85,2.54 IC1.9
N$19
  Bottom 0.406: Q1.2 C2.2 IC1.12
N$20
  Top 0.254: 106.07,26.29 104.47,27.89 101.73,27.89 IC7.4 | 106.07,26.29 112.7,26.29 114.3,27.89 IC8.4 | 106.07,26.29 106.07,18.52 102.87,15.32 IC9.4 | 68.35,26.29 74.52,26.29 76.12,27.89 IC5.4 | 68.35,26.29 68.12,26.29 66.52,27.89 63.55,27.89 IC4.4 | 68.35,26.29 68.35,23.09 62.41,17.14 62.41,8.91 IC1.6
  Top 0.406: JP6.4 68.58,6.35 62.23,6.35 IC1.6
  Bottom 0.254: 101.04,13.26 101.04,4.57 102.87,2.74 IC10.4 | 101.04,13.26 102.87,15.09 IC9.4 | 83.9,26.29 77.95,26.29 76.35,27.89 IC5.4 | 83.9,26.29 87.1,26.29 88.7,27.89 IC6.4 | 101.04,13.26 97.16,13.26 93.95,16.46 90.07,16.46 89.38,17.14 89.38,18.75 85.72,22.4 84.58,22.4 83.9,23.09 83.9,26.29
N$21
  Bottom 0.406: R11.2 91.44,31.43 93.98,31.43 IC7.8
N$22
  Top 0.254: IC1.22 95.1,24.23 95.1,24.69 84.81,34.98 84.81,36.8 83.9,37.72 83.21,37.72 82.3,38.63 82.3,40.46 76.35,46.41 76.35,47.32 73.38,50.29 65.38,50.29 X2.2 65.15,50.29 65.15,46.86 62.87,44.58 R2.2 | JP2.2 51.89,36.35 51.89,41.83 51.44,42.29 51.44,49.15 52.58,50.29 X3.2
  Bottom 0.406: X2.2 X3.2
N$24
  Bottom 0.406: IC8.8 106.68,31.75 104.14,31.75 R13.2 104.14,30.16
N$26
  Bottom 0.406: R15.2 112.71,20.8 112.71,22.86 IC9.8
N$27
  Bottom 0.406: SL6.5 46.84,22.86 R29.2
N$28
  Top 0.254: IC4.3 61.04,28.12 61.49,28.12 63.09,29.72 72.01,29.72 73.61,28.12 IC5.3 75.44,29.72 76.58,29.72 77.27,29.03 77.27,26.75 76.35,25.83 74.52,25.83 73.84,25.15 73.84,23.32 67.44,16.92 67.44,8.91 IC1.8 | 101.27,16 102.87,17.6 IC9.3 | 101.27,16 101.04,15.77 101.04,14.86 104.7,11.2 104.7,7.09 102.87,5.26 IC10.3 102.87,5.03 83.21,5.03 79.55,1.37 70.64,1.37 69.49,2.52 68.58,2.52 JP6.3 | 97.61,26.52 98.98,27.89 IC7.3 99.21,28.12 100.81,29.72 109.96,29.72 111.56,28.12 IC8.3 | 97.61,26.52 96.7,25.6 96.7,23.32 95.78,22.4 94.87,22.4 94.18,23.09 94.18,24.92 92.81,26.29 88.47,26.29 86.87,27.89 86.41,27.89 IC6.3 | 101.27,16 98.3,18.97 98.3,22.4 98.98,23.09 98.98,25.15 97.61,26.52
  Bottom 0.406: JP6.3 67.31,2.54 IC1.8
N$29
  Bottom 0.254: R21.2 11.66,13.03 11.66,15.32 12.8,16.46 12.8,21.03 10.97,22.86 SL4.4
N$30  (via drill 0.61)
  Top 0.254: v8.69,11.2 8.69,12.8 R20.1 | v20.12,5.49 20.12,2.52 19.89,2.29 18.75,2.29 18.29,2.74 18.29,3.66 IC21.6
  Bottom 0.254: R20.1 8.69,12.8 v8.69,11.2 9.6,11.2 13.72,7.09 13.72,6.63 14.86,5.49 v20.12,5.49
N$31
  Bottom 0.406: IC4.8 55.88,37.47 65.89,37.47 R5.2
N$32  (via drill 0.61)
  Top 0.254: R33.1 40.46,12.8 40.46,12.34 v39.32,11.2 37.95,9.83 37.95,9.14 IC22.9
  Bottom 0.254: v39.32,11.2 40.46,12.34 40.46,12.8 R33.1
N$33
  Top 0.254: IC2.14 16.69,35.66 16.69,40.92 18.75,42.98 X4.2
N$34  (via drill 0.61)
  Top 0.254: R30.1 34.06,12.8 v32.69,11.43 32,11.43 30.63,10.06 30.63,7.77 31.09,7.32 31.77,7.32 32.69,8.23 32.69,8.91 IC22.13
  Bottom 0.254: v32.69,11.43 34.06,12.8 R30.1
N$35
  Bottom 0.406: C1.2 69.85,20.95 IC1.32
N$36
  Bottom 0.254: R11.1 91.44,35.2 93.5,37.26 94.64,37.26 95.78,38.41 95.78,48.01 89.38,54.41 83.9,54.41 82.53,53.03 82.53,48.23 IC11.13
  Bottom 0.406: R10.1 81.28,44.45 IC11.13
N$37
  Bottom 0.406: C3.2 Q1.1 83.82,2.54 83.82,5.08 80.01,5.08 IC1.13
N$38
  Bottom 0.254: R9.1 78.87,33.38 78.87,35.43 81.15,37.72 94.41,37.72 95.33,38.63 95.33,47.78 94.41,48.69 93.04,48.69 91.44,47.09 IC11.9
  Bottom 0.406: R8.1 91.29,46.84 IC11.9
N$39
  Bottom 0.406: R17.2 110.49,10.64 IC10.8
N$40
  Bottom 0.254: R15.1 114.3,25.83 115.44,26.98 115.44,36.58 114.3,37.72 113.84,37.72 112.93,38.63 112.93,40.46 113.03,42.55 109.22,42.55 109.22,43.16 104.01,43.16 101.96,44.58 R14.1
  Bottom 0.406: R14.1 101.75,46.84 IC12.13
N$41  (via drill 0.61)
  Top 0.254: 13.95,13.03 15.09,13.03 R22.1 | 13.95,13.03 10.97,10.06 10.97,7.77 11.43,7.32 12.12,7.32 12.8,8 12.8,8.91 IC21.13 | 13.95,13.03 v13.49,13.03
  Bottom 0.254: v13.49,13.03 15.09,13.03 R22.1
N$42
  Bottom 0.406: R3.1 49.53,11.43 IC1.1
N$43  (via drill 0.6)
  Top 0.406: v50.8,5.08 48.26,5.08 LED1.3
  Bottom 0.406: R3.2 50.8,11.43 v50.8,5.08
N$44  (via drill 0.61)
  Top 0.254: v26.29,18.52 24.69,18.52 R44.2 | v20.34,10.52 17.6,10.52 16.92,9.83 16.92,9.14 IC21.10
  Bottom 0.254: 25.6,18.52 24.69,18.52 R44.2 | 25.6,18.52 v26.29,18.52 | v20.34,10.52 20.8,10.52 21.03,10.29 24,10.29 25.6,11.89 25.6,18.52
N$45  (via drill 0.61)
  Top 0.254: v21.49,11.2 21.49,12.8 R24.1 | v12.8,6.63 13.72,5.71 18.75,5.71 18.97,5.94 18.97,7.32 18.29,8 18.29,8.91 IC21.9
  Bottom 0.254: v21.49,11.2 21.49,12.8 R24.1 21.26,13.03 21.26,13.72 19.2,15.77 19.2,23.77 18.29,24.69 10.29,24.69 9.6,24 9.6,21.72 10.06,21.26 10.06,17.37 7.54,14.86 7.54,10.97 11.89,6.63 v12.8,6.63
N$46
  Bottom 0.406: JP4.1 52.07,5.08 IC1.2
N$47  (via drill 0.61)
  Top 0.254: R26.1 30.63,12.8 v29.26,11.43 29.26,8.46 32.69,5.03 32.69,3.89 IC22.2
  Bottom 0.254: v29.26,11.43 27.89,12.8 R27.1
N$48
  Bottom 0.254: R47.1 27.66,18.52 27.66,20.8 25.6,22.86 SL5.4
N$49  (via drill 0.61)
  Top 0.254: v11.66,16.69 11.66,18.29 R41.1 | v20.57,7.77 21.03,7.32 21.03,2.74 20.12,1.83 18.06,1.83 16.92,2.97 16.92,3.66 IC21.5
  Bottom 0.254: R41.1 11.66,18.29 v11.66,16.69 10.29,15.32 10.29,11.89 10.52,11.66 13.26,11.66 17.14,7.77 v20.57,7.77
N$52
  Bottom 0.254: R48.1 34.06,18.52 34.06,21.95 33.15,22.86 SL6.1
N$53
  Bottom 0.254: R31.2 36.8,13.03 36.8,16.23 35.66,17.37 35.66,22.86 SL6.2
N$54
  Bottom 0.254: SL5.3 23.09,22.63 23.09,17.6 24.23,16.46 24.23,13.03 R25.2
N$55
  Bottom 0.254: R7.2 72.69,39.32 72.24,39.32 68.58,35.66 IC5.8
N$56
  Top 0.254: 31.43,34.98 42.75,34.98 46.18,31.55 46.18,31.09 47.32,29.95 48.01,29.95 50.98,32.92 50.98,50.98 52.58,52.58 70.87,52.58 72.69,54.41 93.27,54.41 94.18,53.49 94.18,50.52 T1.E
  Top 0.406: D1.C 31.43,36.83 31.43,34.98 31.43,30.98 C26.1 33.02,31.11 IC3.IN
N$57
  Bottom 0.254: R13.1 104.01,33.38 104.01,37.03 101.73,39.32 IC12.2
  Bottom 0.406: R12.1 101.6,41.91 IC12.2
N$58  (via drill 0.6, 0.61)
  Top 0.254: v107.9,22.4 v107.9,15.54 | v110.41,41.41 110.41,43.81 v110.17,43.81
  Bottom 0.254: R17.1 109.96,13.49 v107.9,15.54 | v107.9,22.4 111.78,26.29 112.24,26.29 113.16,27.2 113.16,36.35 111.78,37.72 111.33,37.72 110.41,38.63 v110.41,41.41 | R17.1 | 111.56,44.12 R16.1 v110.17,43.81
  Bottom 0.406: R16.1 111.61,46.84 IC12.9
N$59  (via drill 0.6)
  Top 0.254: 85.04,42.98 85.04,48.01 82.75,50.29 82.75,53.26 83.44,53.95 89.38,53.95 90.75,52.58 93.27,52.58 T1.C
  Top 0.406: 85.04,42.98 87.95,42.98 87.95,42.86 | 87.95,42.86 v87.95,42.23 | IC12.4 106.68,42.86 87.95,42.86
  Bottom 0.254: 86.18,41.83 C24.1 86.41,41.83 | 106.53,41.83 C25.1
  Bottom 0.406: 86.41,41.83 86.36,41.83 C24.1 | C24.1 IC11.4 | v87.95,42.23 86.36,42.23 C24.1 | 106.53,41.83 106.68,41.83 IC12.4
N$60
  Bottom 0.254: R27.2 30.4,13.03 30.4,16.23 29.03,17.6 29.03,21.95 28.12,22.86 SL5.5
N$61  (via drill 0.61)
  Top 0.254: v96.93,46.18 94.41,48.69 94.18,48.69 92.58,50.29 T1.B | v102.87,26.29 102.87,25.15 99.21,21.49 v99.21,19.43
  Bottom 0.254: v96.93,46.18 96.93,39.32 98.53,37.72 101.73,37.72 102.87,36.58 v102.87,26.29 | v99.21,19.43 92.58,19.43 90.98,17.83 R37.2
N$63
  Bottom 0.254: T2.C 88.24,15.09 88.24,17.6 R37.1
N$64
  Bottom 0.406: R36.2 89.22,12.7 T2.B
N$65
  Bottom 0.254: R38.1 2.97,18.52 2.97,22.86 SL4.1
N$66
  Bottom 0.254: R40.1 8.69,18.52 8.69,22.63 8.46,22.86 SL4.3
N$67  (via drill 0.61)
  Top 0.254: R39.1 5.94,18.29 v5.94,16.69 4.34,16.69 1.83,14.17 1.83,11.66 11.2,2.29 13.49,2.29 14.17,2.97 14.17,3.66 IC21.3
  Bottom 0.254: v5.94,16.69 5.94,18.29 R38.2
N$68
  Bottom 0.254: R42.2 15.09,18.52 15.09,21.26 13.49,22.86 SL4.5
N$69
  Bottom 0.254: SL4.2 4.57,21.72 4.57,16.69 5.71,15.54 5.71,13.03 R19.2
N$70
  Bottom 0.254: R44.1 21.72,18.52 21.72,21.49 20.34,22.86 SL5.2
N$72  (via drill 0.61)
  Top 0.254: v32.23,18.52 30.63,18.52 R46.1 | v27.2,7.77 27.2,5.94 30.86,2.29 33.15,2.29 33.83,2.97 33.83,3.66 IC22.3
  Bottom 0.254: 31.77,18.52 30.63,18.52 R46.1 | v27.2,7.77 27.66,7.77 31.77,11.89 31.77,18.52 | 31.77,18.52 v32.23,18.52
N$73  (via drill 0.61)
  Top 0.254: v77.27,46.86 77.27,46.18 82.3,41.15 84.12,41.15 85.27,40.01 85.27,38.18 85.72,37.72 86.87,37.72 87.78,38.63 87.78,40.46 88.47,41.15 89.84,41.15 91.44,39.55 IC11.6
  Bottom 0.254: v77.27,46.86 77.27,46.18 75.21,44.12 71.09,44.12 67.44,40.46 67.44,38.41 67.89,37.95 69.49,37.95 69.95,38.41 69.95,38.63 72.01,40.69 73.84,40.69 74.98,39.55 75.67,39.55 R7.1
  Bottom 0.406: R6.1 91.12,41.91 91.12,39.69 IC11.6
N$74  (via drill 0.61)
  Top 0.254: v38.63,18.52 37.03,18.52 R48.2 | v37.49,11.2 35.43,11.2 34.06,9.83 34.06,9.14 IC22.12
  Bottom 0.254: 38.18,18.52 37.03,18.52 R48.2 | v37.49,11.2 38.18,11.89 38.18,18.52 | 38.18,18.52 v38.63,18.52
N$76
  Bottom 0.254: R50.1 40.46,18.52 40.46,20.57 38.18,22.86 SL6.3
N$79
  Bottom 0.254: R23.2 17.83,13.03 17.83,15.77 16.69,16.92 16.69,21.95 17.6,22.86 SL5.1
N$80  (via drill 0.61)
  Top 0.254: v18.29,16.69 18.29,18.06 18.06,18.29 R43.1 | v19.2,11.43 17.83,11.43 16.92,10.52 15.09,10.52 14.4,9.83 14.4,9.14 IC21.12
  Bottom 0.254: R43.1 18.06,18.29 18.06,16.92 v18.29,16.69 18.29,16 19.2,15.09 v19.2,11.43
N$89
  Bottom 0.254: R33.2 43.2,13.03 43.2,16.23 41.83,17.6 41.83,21.72 40.69,22.86 SL6.4
N$90  (via drill 0.61)
  Top 0.254: v45.03,18.52 43.43,18.52 R50.2 | v40.01,7.32 37.49,7.32 36.58,8.23 36.58,8.91 IC22.10
  Bottom 0.254: 44.58,18.52 43.43,18.52 R50.2 | v40.01,7.32 44.58,11.89 44.58,18.52 | 44.58,18.52 v45.03,18.52
N$91
  Bottom 0.254: R5.1 68.81,39.55 70.18,39.55 71.78,41.15 76.12,41.15 77.72,39.55 77.72,38.18 78.18,37.72 79.55,37.72 81.15,39.32 IC11.2
  Bottom 0.406: IC11.2 81.43,39.37 R4.1
N$96
  Top 0.254: IC12.6 111.78,39.55 114.3,39.55 IC12.7
SFET1
  Bottom 0.254: SL1.1 78.87,51.89 78.87,47.09 IC11.14
  Bottom 0.406: R10.2 78.74,44.45 IC11.14
SFET2
  Bottom 0.254: SL1.2 81.15,51.89 81.15,49.15 79.78,47.78 79.78,43.2 78.64,42.06 R4.2
  Bottom 0.406: R4.2 78.59,39.52 IC11.1
SFET3
  Top 0.254: SL1.3 83.9,51.89 84.35,51.89 87.55,48.69 92.35,48.69 93.95,47.09 IC11.8
  Bottom 0.406: R8.2 94.13,46.84 IC11.8
SFET4
  Bottom 0.254: SL1.4 86.41,51.89 90.07,48.23 90.07,43.43 90.3,43.2 92.81,43.2 93.95,42.06 R6.2
  Bottom 0.406: R6.2 94.13,39.52 IC11.7
SFET5
  Top 0.254: SL2.1 97.84,51.89 97.84,48.23 98.98,47.09 IC12.14
  Bottom 0.406: R14.2 98.91,46.84 IC12.14
SFET6
  Bottom 0.254: SL2.2 100.13,51.89 100.13,43.2 98.98,42.06 R12.2
  Bottom 0.406: R12.2 98.91,39.52 IC12.1
SFET7
  Top 0.254: IC12.8 114.3,49.21 110.81,49.21 110.81,49.64 103.03,49.64 103.01,51.89 102.87,51.89 SL2.3
  Bottom 0.406: R16.2 114.3,43.81 IC12.8
U
  Bottom 0.406: IC1.40 49.53,20.95 R29.1 49.68,20.32 R28.1 52.58,20.32 C28.1
VDD  (via drill 0.6)
  Top 0.254: IC6.1 81.15,28.12 81.15,32.69 76.58,37.26 75.44,37.26 73.84,35.66 IC5.6 73.61,35.43 73.15,35.43 71.55,33.83 67.44,33.83 64.01,37.26 60.96,37.26 | IC6.6 86.41,35.43 93.95,27.89 IC7.1 | IC8.6 111.78,35.43 112.24,35.43 113.84,33.83 114.76,33.83 115.44,34.52 115.44,36.58 114.3,37.72 103.1,37.72 102.64,37.26 100.81,37.26 99.21,35.66 IC7.6 | JP7.4 29.26,51.89 30.63,51.89 41.83,40.69 41.83,39.32 44.35,36.8 44.35,36.35 JP3.1 44.58,36.12 47.55,33.15 47.55,31.32 IC13.OUT | IC4.1 56.01,27.89 57.61,26.29 64.69,26.29 65.84,25.15 65.84,21.26 58.29,13.72 58.29,5.26 JP1.1 58.06,5.03 56.92,3.89 53.03,3.89 50.75,1.6 48.23,1.6 47.32,2.52 LED1.1 47.09,2.52 40.23,2.52 39.32,1.6 35.43,1.6 v35.24,1.59 IC22.4 | IC21.4 v15.56,1.59
  Top 0.406: R1.1 54.61,40.64 60.33,40.64 R2.1 60.96,39.37 60.96,37.26 IC4.6
  Bottom 0.254: 105.09,10.16 105.16,10.29 105.16,17.6 105.09,17.65 | 105.09,22.86 106.3,22.86 110.41,26.98 110.41,30.16 110.41,30.18 | R1.1 54.41,39.32 54.41,35.43 50.98,32 C23.1 | IC2.16 11.43,35.66 11.89,35.66 18.29,42.06 19.43,42.06 20.34,42.98 20.34,44.12 21.72,45.49 21.72,46.18 27.43,51.89 29.03,51.89 JP7.4 | v15.56,1.59 C9.1 15.77,4.34 35.2,4.34 C10.1 v35.24,1.59
  Bottom 0.406: IC10.6 106.68,5.08 C16.1 105.09,4.95 105.09,10.16 IC10.1 | IC9.6 106.68,17.78 C22.1 105.09,17.65 105.09,22.86 IC9.1 | IC8.6 111.76,31.75 C21.1 112.08,31.75 112.08,30.16 110.41,30.16 106.68,30.16 IC8.1 | IC7.6 99.06,31.75 C20.1 99.38,31.75 99.38,30.16 93.98,30.16 IC7.1 | 86.36,31.75 IC6.6 | C18.1 86.36,31.75 | 86.36,31.75 86.36,29.84 81.28,29.84 IC6.1 | C17.1 73.66,31.75 | 73.66,31.75 IC5.6 | 73.66,31.75 73.66,30.16 68.58,30.16 IC5.1 | 60.96,31.75 IC4.6 | C19.1 60.96,31.75 | 60.96,31.75 60.96,30.16 55.88,30.16 IC4.1 | C23.1 50.8,31.11 IC13.OUT | C7.2 7.62,35.56 IC2.16
VREF
  Top 0.254: IC12.3 104.01,39.32 102.41,37.72 90.53,37.72 88.92,39.32 IC11.5 | R34.2 40.69,27.2 41.15,27.2 42.29,26.06 44.81,26.06 53.49,34.75 53.49,40.46 58.75,45.72 60.35,45.72 61.04,46.41 61.04,48.46 64.69,52.12 76.35,52.12 79.78,48.69 82.07,48.69 83.67,47.09 IC11.12 | IC12.12 104.01,46.86 103.56,46.86 101.96,45.26 90.53,45.26 88.92,46.86 IC11.10
  Top 0.406: R35.1 R34.2 | IC12.10 109.22,48.9 104.14,48.9 IC12.12
  Bottom 0.406: IC11.5 88.9,43.18 | 88.9,43.18 IC11.10 | IC11.12 83.82,43.18 | 83.82,43.18 88.9,43.18 | IC11.3 83.82,43.18

### Text on the board
Top: 1
Bottom: electronic load | V02.0